# EAGLE schematic m1_board (EAGLE 6.2)
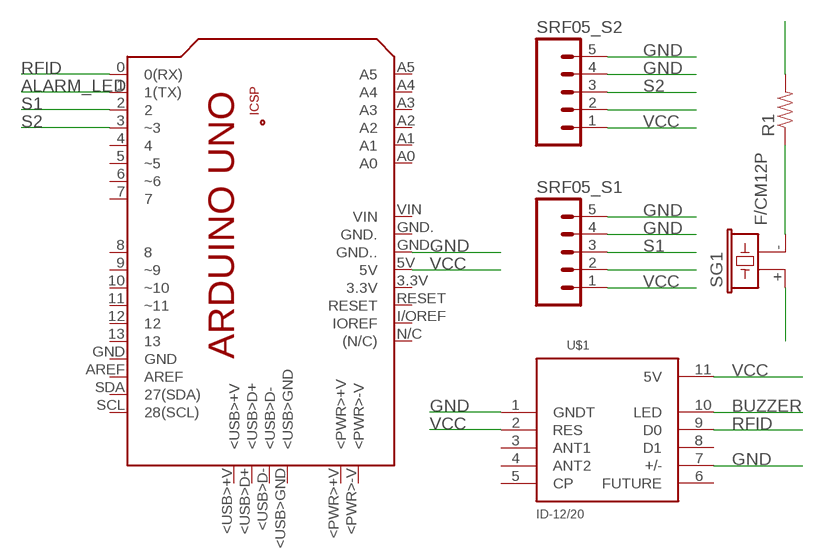
[diagram p0: schematic, sheet 1]

## Parts
PCB1  ARDUINO_UNO  [ARDUINO_UNO]
R1  RESISTORPTH-1/4W  [AXIAL-0.4]
SG1  F/CM12P  [F/CM12P]
SRF05_S1  M05PTH  [1X05]
SRF05_S2  M05PTH  [1X05]
U$1  ID-12/20  [ID-12]

## Nets
ALARM_LED: PCB1.1(1(TX))
BUZZER: R1.P$2 U$1.10(LED)
GND: PCB1.GND.. SRF05_S1.4 SRF05_S1.5 SRF05_S2.4 SRF05_S2.5 U$1.1(GNDT) U$1.7(+/-)
N$1: R1.P$1 SG1.-
N$4: SRF05_S2.2
N$9: SRF05_S1.2
RFID: PCB1.0(0(RX)) U$1.9(D0)
S1: PCB1.2 SRF05_S1.3
S2: PCB1.3(~3) SRF05_S2.3
VCC: PCB1.5V SG1.+ SRF05_S1.1 SRF05_S2.1 U$1.2(RES) U$1.11(5V)
Unconnected: PCB1.3.3V PCB1.4 PCB1.5(~5) PCB1.6(~6) PCB1.7 PCB1.8 PCB1.9(~9) PCB1.10(~10) PCB1.11(~11) PCB1.12 PCB1.13 PCB1.+5V PCB1.<PWR>+V PCB1.<PWR>-V PCB1.<USB>+V PCB1.<USB>D+ PCB1.<USB>D- PCB1.<USB>GND PCB1.A0 PCB1.A1 PCB1.A2 PCB1.A3 PCB1.A4 PCB1.A5 PCB1.AREF PCB1.GND PCB1.GND. PCB1.GND_ PCB1.I/OREF(IOREF) PCB1.MISO PCB1.MOSI PCB1.N/C((N/C)) PCB1.RESET PCB1.RESET. PCB1.SCK PCB1.SCL(28(SCL)) PCB1.SDA(27(SDA)) PCB1.VIN U$1.3(ANT1) U$1.4(ANT2) U$1.5(CP) U$1.6(FUTURE) U$1.8(D1)

## Library data of the parts
PCB1 = E14_Arduino:ARDUINO_UNO: Device for representing an Arduino Uno board with a footprint in an EAGLE design. Created by Dave Young for Element14. More EAGLE documentation at: http://www.element14.com/community/community/knode/cadsoft_eagle
R1 = SparkFun-Passives:RESISTOR: Resistor Basic schematic elements and footprints for 0603, 1206, and PTH resistors.
SG1 = buzzer:F/CM12P: BUZZER Source: Buerklin; OC_FARNELL: unknown; OC_NEWARK: unknown
SRF05_S1 SRF05_S2 = SparkFun-Connectors:M05: Header 5 Standard 5-pin 0.1" header. Use with straight break away headers (SKU : PRT-00116), right angle break away headers (PRT-00553), swiss pins (PRT-00743), machine pins (PRT-00117), and female headers (PRT-00115). Molex polarized connector foot print use with SKU : PRT-08230 with associated crimp pins and housings.
U$1 = SparkFun-RF:ID-12/20: RFID reader for ID2, ID12, and ID20 Package